# Altium schematic sheet Walrus Power.SchDoc: Power
size B; PageSetup: Record=PageOptions|CenterHorizontal=True|CenterVertical=True|PrintScale=1.05|XCorrection=1.00|YCorrection=1.00|PrintKind=2|BorderSize=5000000|LeftOffset=0|BottomOffset=0|Orientation=2|PaperLength=1000|PaperWidth=1000|Scale=100|PaperSource=7|PrintQuality=-4|MediaType=1|DitherType=10|PaperKind=Letter|PrintScaleMode=1; Organization: Morewood Design Labs, Inc.; Address1: 5001 Baum Blvd.; Address2: Suite 675; Address3: Pittsburgh, PA 15213; Address4: 412-687-1110; SheetNumber: 2; SheetTotal: 4; Client: Test; Project: {ENTER PROJECT}; MdlPcbNumber: Test; ClientPcbNumber: Test; ClientPcbaNumber: Test; ClientPcbaRev: Test; ClientPcbRev: Test; ProjectName: Walrus
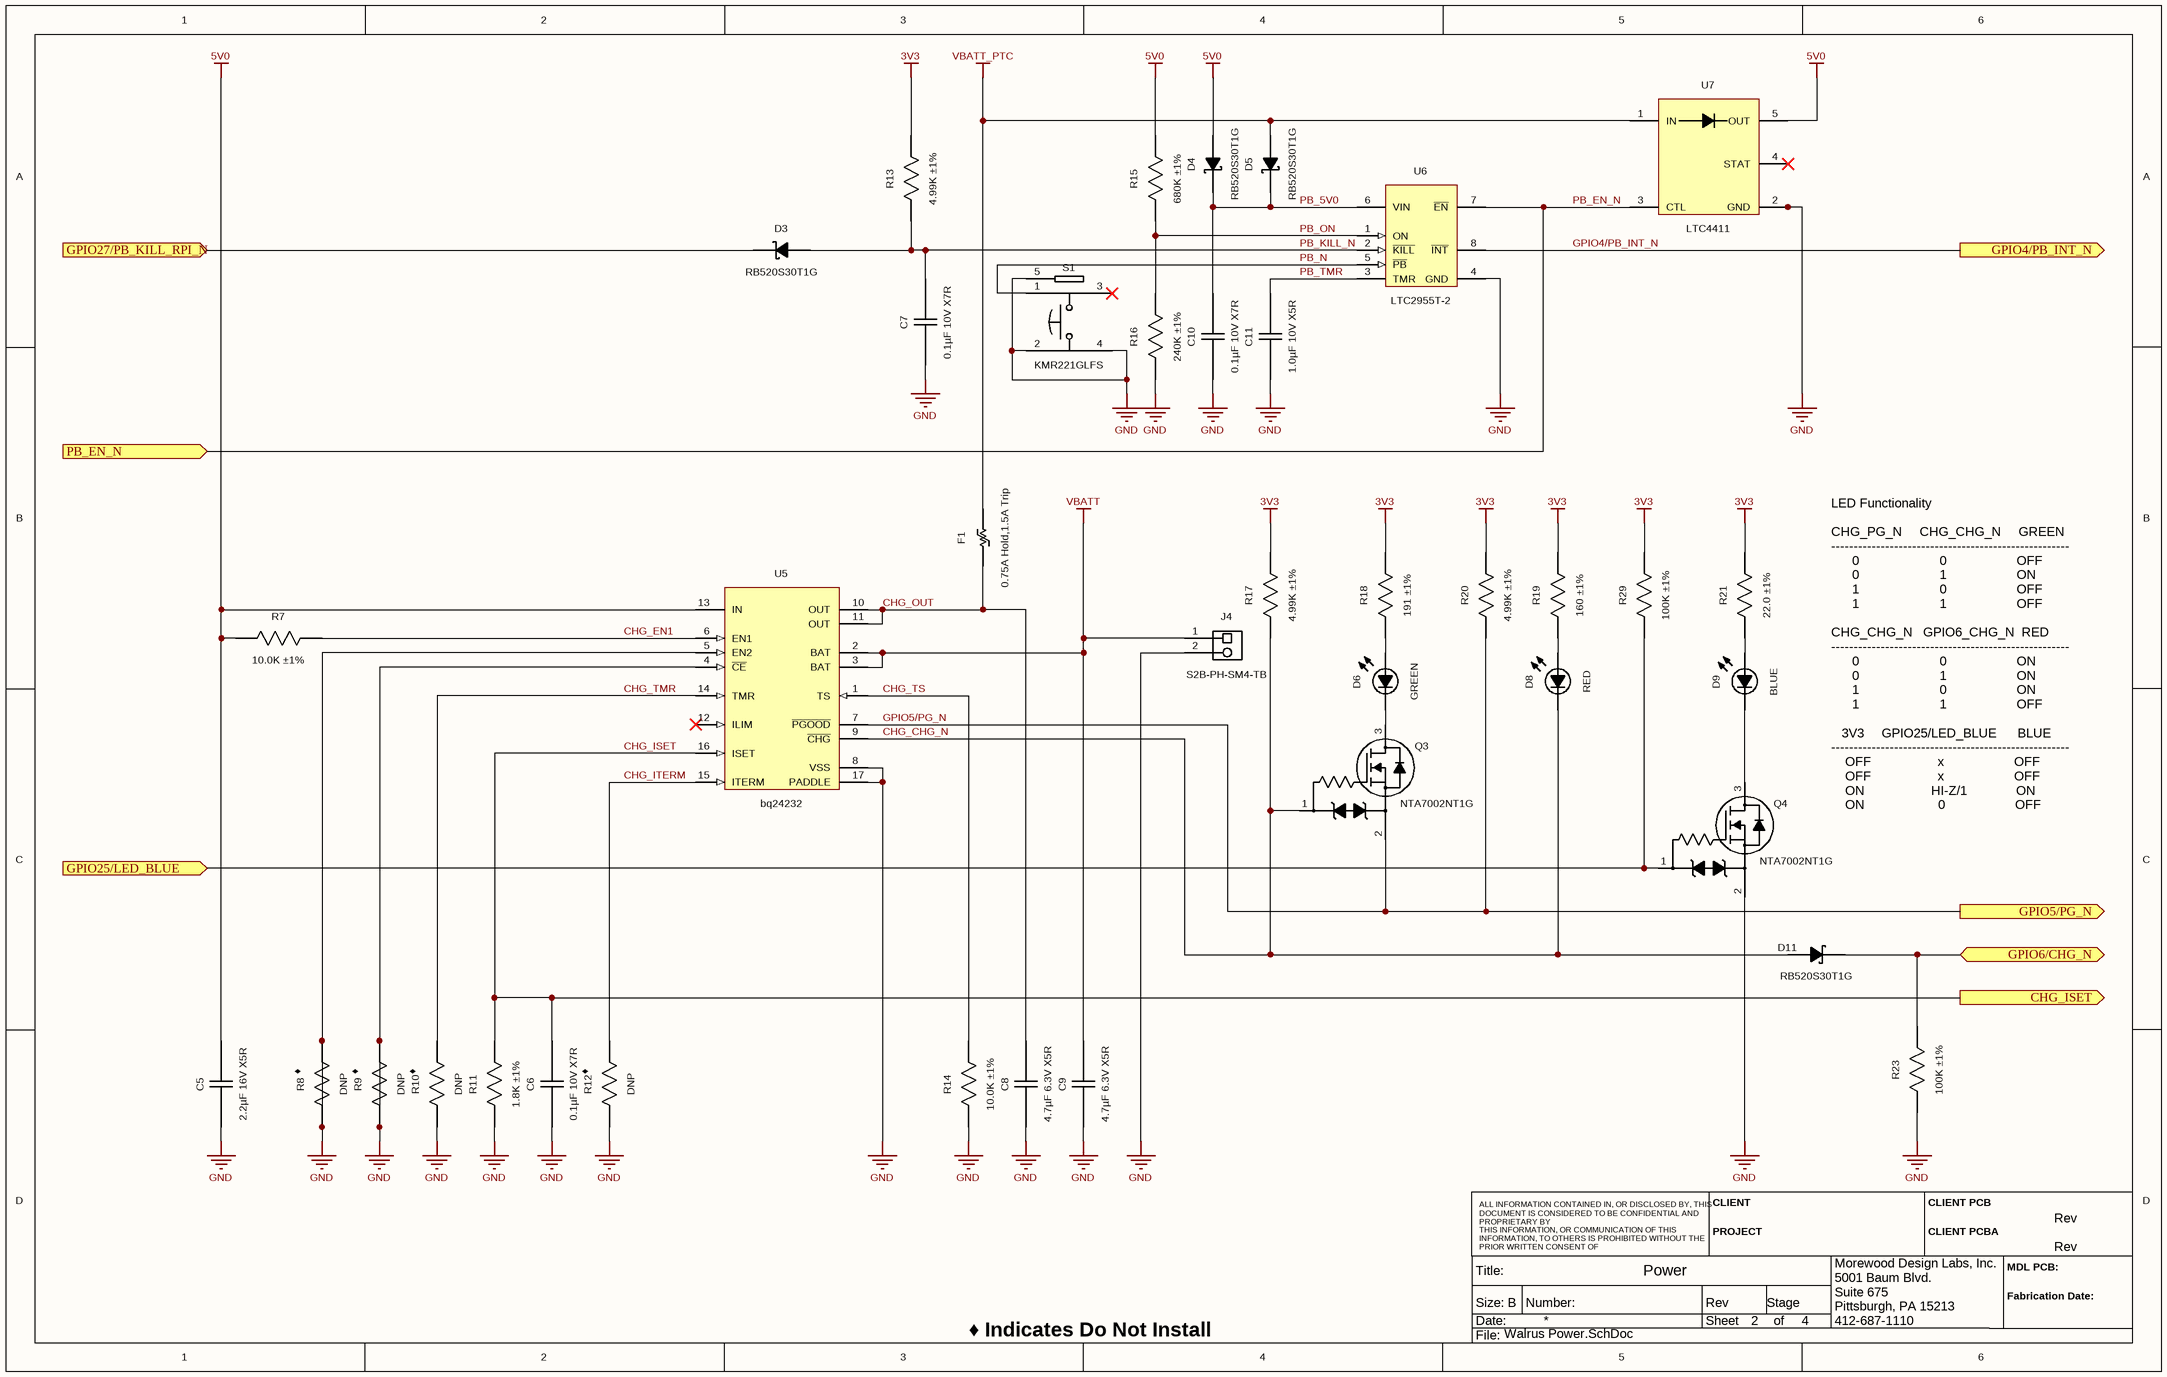
[diagram p0: Walrus Power.SchDoc]

## Parts
C5  2.2µF 16V X5R  [CAPC1005X60L(0402)]
C6  0.1µF 10V X7R  [CAPC1005X60L(0402_FLEXTRONICS)]
C7  0.1µF 10V X7R  [CAPC1005X60L(0402_FLEXTRONICS)]
C8  4.7µF 6.3V X5R  [CAPC1005X60L(0402)]
C9  4.7µF 6.3V X5R  [CAPC1005X60L(0402)]
C10  0.1µF 10V X7R  [CAPC1005X60L(0402_FLEXTRONICS)]
C11  1.0µF 10V X5R  [CAPC1005X60L(0402_FLEXTRONICS)]
D3  RB520S30T1G  [SODFL1608X70L(SOD-523)]
D4  RB520S30T1G  [SODFL1608X70L(SOD-523)]
D5  RB520S30T1G  [SODFL1608X70L(SOD-523)]
D6  GREEN  [DIOC1608X90L(0603)_GREEN]
D8  RED  [DIOC1608X90L(0603)_RED]
D9  BLUE  [DIOC1608X90L(0603)_BLUE]
D11  RB520S30T1G  [SODFL1608X70L(SOD-523)]
F1  0.75A Hold,1.5A Trip  [FUSC1608X60N(0603)]
J4  S2B-PH-SM4-TB  [JST_S2B-PH-SM4-TB]
Q3  NTA7002NT1G  [SOT50P160X90-3L(SOT416, SC75)]
Q4  NTA7002NT1G  [SOT50P160X90-3L(SOT416, SC75)]
R7  10.0K ±1%  [RESC1005X40L(0402)]
R8  DNP  DNI: ♦  [RESC1005X40L(0402)_DNP]
R9  DNP  DNI: ♦  [RESC1005X40L(0402)_DNP]
R10  DNP  DNI: ♦  [RESC1005X40L(0402)_DNP]
R11  1.8K ±1%  [RESC1005X40L(0402)]
R12  DNP  DNI: ♦  [RESC1005X40L(0402)_DNP]
R13  4.99K ±1%  [RESC1005X40L(0402)]
R14  10.0K ±1%  [RESC1005X40L(0402)]
R15  680K ±1%  [RESC1005X40L(0402)]
R16  240K ±1%  [RESC1005X40L(0402)]
R17  4.99K ±1%  [RESC1005X40L(0402)]
R18  191 ±1%  [RESC1005X40L(0402)]
R19  160 ±1%  [RESC1005X40L(0402)]
R20  4.99K ±1%  [RESC1005X40L(0402)]
R21  22.0 ±1%  [RESC1005X40L(0402)]
R23  100K ±1%  [RESC1005X40L(0402)]
R29  100K ±1%  [RESC1005X40L(0402)]
S1  KMR221GLFS  [KMR221GLFS]
U5  bq24232  [QFN50P300X300X100-17N(bq24232)]
U6  LTC2955T-2  [SOT65P280X100-8L(TSOT23-8)]
U7  LTC4411  [SOT95P280X100-5L(TSOT23 -5)]

## Ports
CHG_ISET (out), GPIO4/PB_INT_N (out), GPIO5/PG_N (out), GPIO6/CHG_N (bidir), GPIO25/LED_BLUE (in), GPIO27/PB_KILL_RPI_N (in), PB_EN_N (in)

## Nets
3V3: R13.2 R17.2 R18.2 R19.2 R20.2 R21.2 R29.2
5V0: C5.2 D4.2(A) R7.1 R15.2 U5.13(IN) U7.5(OUT)
GND: C5.1 C6.1 C7.1 C8.1 C9.1 C10.1 C11.1 J4.2 Q4.2(S) R8.1 R8.2 R9.1 R9.2 R10.1 R11.1 R12.1 R14.1 R16.1 R23.1 S1.2(B) S1.4(B') S1.5(BODY) U5.4(~{CE}) U5.5(EN2) U5.8(VSS) U5.17(PADDLE) U6.4(GND) U7.2(GND)
VBATT: C9.2 J4.1 U5.2(BAT) U5.3(BAT)
VBATT_PTC: D5.2(A) F1.2 U7.1(IN)
CHG_CHG_N: D8.1(K) D11.2(A) Q3.1(G) R17.1 U5.9(~{CHG})
CHG_EN1: R7.2 U5.6(EN1)
CHG_ISET: C6.2 R11.2 U5.16(ISET) ; port CHG_ISET
CHG_ITERM: R12.2 U5.15(ITERM)
CHG_OUT: C8.2 F1.1 U5.10(OUT) U5.11(OUT)
CHG_TMR: R10.2 U5.14(TMR)
CHG_TS: R14.2 U5.1(TS)
GPIO4/PB_INT_N: U6.8(~{INT}) ; port GPIO4/PB_INT_N
GPIO5/PG_N: Q3.2(S) R20.1 U5.7(~{PGOOD}) ; port GPIO5/PG_N
GPIO6/CHG_N: D11.1(K) R23.2 ; port GPIO6/CHG_N
GPIO25/LED_BLUE: Q4.1(G) R29.1 ; port GPIO25/LED_BLUE
GPIO27/PB_KILL_RPI_N: D3.1(K) ; port GPIO27/PB_KILL_RPI_N
PB_5V0: C10.2 D4.1(K) D5.1(K) U6.6(VIN)
PB_EN_N: U6.7(~{EN}) U7.3(CTL) ; port PB_EN_N
PB_KILL_N: C7.2 D3.2(A) R13.1 U6.2(~{KILL})
PB_N: S1.1(A) U6.5(~{PB})
PB_ON: R15.1 R16.2 U6.1(ON)
PB_TMR: C11.2 U6.3(TMR)
NetD6_1: D6.1(K) Q3.3(D)
NetD6_2: D6.2(A) R18.1
NetD8_2: D8.2(A) R19.1
NetD9_1: D9.1(K) Q4.3(D)
NetD9_2: D9.2(A) R21.1

Not connected (* = marked no-connect by the designer): S1 3(A')*; U5 12(ILIM)*; U7 4(STAT)*

## Notes on the sheet
- LED Functionality
  CHG_PG_N     CHG_CHG_N     GREEN
  -----------------------------------------------------
  0                       0                    OFF
  0                       1                    ON
  1                       0                    OFF
  1                       1                    OFF
  CHG_CHG_N   GPIO6_CHG_N  RED
  -----------------------------------------------------
  0                       0                    ON
  0                       1                    ON
  1                       0                    ON
  1                       1                    OFF
  3V3     GPIO25/LED_BLUE      BLUE
  -----------------------------------------------------
  OFF                   x                    OFF
  OFF                   x                    OFF
  ON                   HI-Z/1              ON
  ON                     0                    OFF
- ♦ Indicates Do Not Install
- ALL INFORMATION CONTAINED IN, OR DISCLOSED BY, THIS DOCUMENT IS CONSIDERED TO BE CONFIDENTIAL AND PROPRIETARY BY
- THIS INFORMATION, OR COMMUNICATION OF THIS INFORMATION, TO OTHERS IS PROHIBITED WITHOUT THE PRIOR WRITTEN CONSENT OF
- CLIENT
- PROJECT
- CLIENT PCB
- CLIENT PCBA
- MDL PCB:
- Rev
- Title:
- Size:
- Date:
- B
- Number:
- Sheet
- Stage
- of
- Fabrication Date:
- File:

## Library data of the parts
C5 = CAP_000166: Ceramic Chip Capacitor; Mfg1PartNumber: C1005X5R1C225K050BC; Tolerance: ±10%; Mfg1: TDK; MDLPartNumber: CAP_000166; Value: 2.2µF; Dialectric: Ceramic; Voltage: 16V; Mounting: SMT; Case: 1005(0402); Height: 0.55mm(21.7mils); Tempco: X5R; OperatingTemp: -55C to 85C; CreationDate: 3/17/2013; Creator: R. Casciola; LeadFree: True; RoHS: True; Packaging: T&R; ComponentLink1Description: Mfg1 Datasheet; ComponentLink1URL: http://product.tdk.com/capacitor/mlcc/en/documents/mlccspec_commercial_general_midvoltage_en.pdf; Distributor: https://www.digikey.com/product-detail/en/tdk-corporation/C1005X5R1C225K050BC/445-9085-1-ND/3661600
C6 C7 C10 = CAP_000208: Ceramic Chip Capacitor; Mfg1PartNumber: GRM155R71A104KA01D; Tolerance: ±10%; Mfg1: Murata; MDLPartNumber: CAP_000208; Value: 0.1µF; Dielectric: Ceramic; Voltage: 10V; Mounting: SMT; Case: 1005(0402); Height: 0.55mm(21.7mils); Tempco: X7R; OperatingTemp: -55C to 125C; CreationDate: 5/29/2017; Creator: R. Casciola; LeadFree: True; RoHS: True; Packaging: T&R; ComponentLink1Description: Mfg1 Datasheet; ComponentLink1URL: http://search.murata.co.jp/Ceramy/image/img/A01X/G101/ENG/GRM155R71A104KA01-01.pdf; Distributor: https://www.digikey.com/product-detail/en/murata-electronics-north-america/GRM155R71A104KA01D/490-6321-1-ND/3845518
C8 C9 = CAP_000063: Ceramic Chip Capacitor; Mfg1PartNumber: GRM155R60J475ME87D; Mfg2PartNumber: JMK105BBJ475MV-F; Tolerance: ±20%; Mfg1: Murata; MDLPartNumber: CAP_000063; Value: 4.7µF; Dialectric: Ceramic; Voltage: 6.3V; Mounting: SMT; Case: 1005(0402); Height: 0.60mm(23.6mils); Tempco: X5R; OperatingTemp: -55C to 85C; CreationDate: 1/29/2011; Creator: R. Casciola; LeadFree: True; RoHS: True; Packaging: T&R; ComponentLink1Description: Mfg1 Datasheet; ComponentLink1URL: http://www.murata.com/products/catalog/pdf/c02e.pdf; ComponentLink2Description: Mfg2 Datasheet; ComponentLink2URL: http://www.yuden.co.jp/or/product/category/capacitor/JMK105BBJ475MV-F.pdf; Mfg2: Taiyo Yuden; Distributor: https://www.digikey.com/product-detail/en/murata-electronics-north-america/GRM155R60J475ME87D/490-5408-1-ND/2175215
C11 = CAP_000094: Ceramic Chip Capacitor; Mfg1PartNumber: 0402ZD105KAT2A; Tolerance: ±10%; Mfg1: AVX; MDLPartNumber: CAP_000094; Value: 1.0µF; Dielectric: Ceramic; Voltage: 10V; Mounting: SMT; Case: 1005(0402); Height: 0.56mm(22.0mils); Tempco: X5R; OperatingTemp: -55C to 85C; CreationDate: 7/19/2011; Creator: R. Casciola; LeadFree: True; RoHS: True; Packaging: T&R; ComponentLink1Description: Mfg1 Datasheet; ComponentLink1URL: http://www.avx.com/docs/Catalogs/cx5r.pdf; Distributor: https://www.digikey.com/product-detail/en/avx-corporation/0402ZD105KAT2A/478-4596-1-ND/1645907
D3-D5 D11 = DIOD_000001: Schottky Barrier Diode; MaxReverseVoltage: 30V; MaxForwardCurrent (mA): 200mA; MaxReverseLeakage: 1.0µA; MaxForwardVoltage: 0.60V@200mA; Mfg1: ON Seminconductor; MDLPartNumber: DIOD_000001; Type: Schottky; Mounting: SMT; Pins: 2; Case: SOD-523; Height: 0.70mm(27.6mils); CreationDate: 4/7/2010; Creator: R. Casciola; LeadFree: True; RoHS: True; Packaging: T&R; Mfg1PartNumber: RB520S30T1G; ComponentLink1Description: Mfg1 Datasheet; ComponentLink1URL: http://www.onsemi.com/pub_link/Collateral/RB520S30T1-D.PDF; Distributor: https://www.digikey.com/product-detail/en/on-semiconductor/RB520S30T1G/RB520S30T1GOSCT-ND/964626
D6 = DIOD_000061: Surface Mounting Chip LED; Mfg1PartNumber: LTST-C190KGKT; Lense: Clear; Mfg1: Lite-On; MDLPartNumber: DIOD_000061; Type: LED; Mounting: SMT; Pins: 2; Case: 1608(0603); Height: 0.80mm(31.5mils); Color: Green; CreationDate: 2/15/2015; Creator: R. Casciola; LeadFree: True; RoHS: True; Packaging: T&R; ComponentLink1Description: Mfg1 Datasheet; ComponentLink1URL: http://optoelectronics.liteon.com/upload/download/DS22-2000-074/S_110_LTST-C190KGKT.pdf; Distributor: https://www.digikey.com/product-detail/en/lite-on-inc/LTST-C190KGKT/160-1435-1-ND/386814
D8 = DIOD_000068: Surface Mounting Chip LED; Mfg1PartNumber: LTST-C190CKT; MaxReverseVoltage: 5V; MaxForwardCurrent (mA): 40mA; PeakPulseCurrent: 200mA; MaxReverseLeakage: 100µA; TypForwardVoltage: 1.8V@20mA; MaxForwardVoltage: 2.4@20mA; MaxPower: 100mW; Lense: Clear; Mfg1: Lite-On; MDLPartNumber: DIOD_000068; Type: LED; Mounting: SMT; Pins: 2; Case: 1608(0603); Height: 0.80mm(31.5mils); Color: Red; CreationDate: 8/24/2016; Creator: R. Casciola; LeadFree: True; RoHS: True; Packaging: T&R; ComponentLink1Description: Mfg1 Datasheet; ComponentLink1URL: http://media.digikey.com/pdf/Data%20Sheets/Lite-On%20PDFs/LTST-C190CKT.pdf; Distributor: https://www.digikey.com/product-detail/en/lite-on-inc/LTST-C190CKT/160-1181-1-ND/269253
D9 = DIOD_000059: Surface Mounting Chip LED; Mfg1PartNumber: LTST-C190TBKT; Lense: Clear; Mfg1: Lite-On; MDLPartNumber: DIOD_000059; Type: LED; Mounting: SMT; Pins: 2; Case: 1608(0603); Height: 0.80mm(31.5mils); Color: Blue; CreationDate: 2/15/2015; Creator: R. Casciola; LeadFree: True; RoHS: True; Packaging: T&R; ComponentLink1Description: Mfg1 Datasheet; ComponentLink1URL: http://optoelectronics.liteon.com/upload/download/DS-22-99-0224/S_110_LTST-C190TBKT(0630).pdf; Distributor: https://www.digikey.com/product-detail/en/lite-on-inc/LTST-C190TBKT/160-1646-1-ND/573586
F1 = FUSE_000007: POLY-FUSE® Resettable PTC, Surface Mount > LoRho Series; Mfg1PartNumber: 0603L075SLYR; I_hold: 0.75A @ 20C; I_trip: 1.5A @ 20C; I_max: 50A; V_max: 6; P_d: 0.6W @ 20C; R_min: 0.05 ohms @ 20C; R1_max: 0.25 ohms @ 20C; Mfg1: Littelfuse; MDLPartNumber: FUSE_000007; Value: 0.75A; Mounting: SMT; Case: 1608(0603); Height: 0.75mm(29.5mils); OperatingTemp: -40C to 85C; CreationDate: 8/20/2015; Creator: R. Casciola; LeadFree: True; RoHS: True; Packaging: T&R; ComponentLink1Description: Mfg1 Datasheet; ComponentLink1URL: http://www.littelfuse.com/~/media/electronics/datasheets/resettable_ptcs/littelfuse_ptc_lorho_datasheet.pdf.pdf; Distributor: https://www.digikey.com/product-detail/en/littelfuse-inc/0603L075SLYR/F5777CT-ND/3661919
J4 = CONN_000190: PH CONNECTOR/2.0MM Pitch Side Entry; Mfg1PartNumber: S2B-PH-SM4-TB,S2B-PH-SM4-TB(LF)(SN); Mfg1: JST; Modifer: R. Casciola; MDLPartNumber: CONN_000190; Mounting: SMT; Height: 5.5mm; CreationDate: 7/4/2017; Creator: R. Casciola; LeadFree: True; RoHS: True; ComponentLink1Description: Mfg1 Datasheet; ComponentLink1URL: http://www.jst-mfg.com/product/pdf/eng/ePH.pdf; Distributor: https://www.digikey.com/product-detail/en/jst-sales-america-inc/S2B-PH-SM4-TB(LF)(SN)/455-1749-1-ND/926846; ModificationDate: 8/24/2017
Q3 Q4 = TRAN_000002: Small Signal MOSFET; Type: MOSFET, N-Channel, Single; MaxVdss: 30V; MaxVgs: ±10V; MaxContinuousDrainCurrent: 154mA; MaxPowerDissipation: 300mW; OperatingJunctionTemperatureRange: -55C to 150C; Modifer: R. Casciola; Mfg1: ON Seminconductor; MDLPartNumber: TRAN_000002; Mounting: SMT; Pins: 3; Case: SOT416, SC75; Height: 0.90mm(35.4mils); CreationDate: 4/8/2010; Creator: R. Casciola; ModificationDate: 5/4/2012; LeadFree: True; RoHS: True; Packaging: T&R; Mfg1PartNumber: NTA7002NT1G; ComponentLink1Description: Mfg1 Datasheet; ComponentLink1URL: http://www.onsemi.com/pub_link/Collateral/NTA7002N-D.PDF; Distributor: https://www.digikey.com/product-detail/en/on-semiconductor/NTA7002NT1G/NTA7002NT1GOSCT-ND/1484663
R7 R14 = RES_000005: Chip Resistor, Thick Film; Mfg1PartNumber: CRCW040210K0FKED; Power: 0.063W; LE Voltage: 50V; Tempco: ±100ppm/C; Mfg1: Vishay/Dale; DNI: *; MDLPartNumber: RES_000005; Value: 10.0K; Tolerance: ±1%; Mounting: SMT; Case: 1005(0402); Height: 0.40mm(15.7mils); Composition: Thick Film; OperatingTemp: -55C to 155C; CreationDate: 4/13/2010; Creator: R. Casciola; LeadFree: True; RoHS: True; Packaging: T&R; ComponentLink1Description: Mfg1 Datasheet; ComponentLink1URL: http://www.vishay.com/docs/20035/dcrcwe3.pdf; Distributor: https://www.digikey.com/product-detail/en/vishay-dale/CRCW040210K0FKED/541-10.0KLCT-ND/1183237
R8-R10 R12 = RES_000064: Chip Resistor, Thick Film; MDLPartNumber: RES_000064; Mounting: SMT; Case: 1005(0402); CreationDate: 12/4/2010; Creator: R. Casciola; LeadFree: True; RoHS: True
R11 = RES_000288: Chip Resistor, Thick Film; Mfg1PartNumber: CRCW04021K80FKED; Mfg2PartNumber: RC0402FR-071K8L; Power: 0.063W; LE Voltage: 50V; Tempco: ±100ppm/°C; Mfg1: Vishay/Dale; DNI: *; MDLPartNumber: RES_000288; Value: 1.8K; Tolerance: ±1%; Mounting: SMT; Case: 1005(0402); Height: 0.40mm(15.7mils); Composition: Thick Film; OperatingTemp: -55C to 155C; CreationDate: 7/23/2017; Creator: R. Casciola; LeadFree: True; RoHS: True; Packaging: T&R; ComponentLink1Description: Mfg1 Datasheet; ComponentLink1URL: http://www.vishay.com/docs/20035/dcrcwe3.pdf; Mfg2: Yageo; ComponentLink2Description: Mfg2 Datasheet; ComponentLink2URL: http://www.yageo.com/NewPortal/yageodocoutput?fileName=/pdf/R-Chip/PYu-RC_Group_51_RoHS_L_5.pdf; Distributor: https://www.digikey.com/product-detail/en/vishay-dale/CRCW04021K80FKED/541-1.80KLCT-ND/1183150
R13 R17 R20 = RES_000003: Chip Resistor, Thick Film; Mfg1PartNumber: CRCW04024K99FKED; Power: 0.063W; LE Voltage: 50V; Tempco: ±100ppm/C; Mfg1: Vishay/Dale; DNI: *; MDLPartNumber: RES_000003; Value: 4.99K; Tolerance: ±1%; Mounting: SMT; Case: 1005(0402); Height: 0.40mm(15.7mils); Composition: Thick Film; OperatingTemp: -55C to 155C; CreationDate: 4/6/2010; Creator: R. Casciola; LeadFree: True; RoHS: True; Packaging: T&R; ComponentLink1Description: Mfg1 Datasheet; ComponentLink1URL: http://www.vishay.com/docs/20035/dcrcwe3.pdf; Distributor: https://www.digikey.com/product-detail/en/vishay-dale/CRCW04024K99FKED/541-4.99KLCT-ND/1183202
R15 = RES_000103: Chip Resistor, Thick Film; Mfg1PartNumber: CRCW0402680KFKED; Power: 0.063W; LE Voltage: 50V; Tempco: ±100ppm/C; Mfg1: Vishay/Dale; DNI: *; MDLPartNumber: RES_000103; Value: 680K; Tolerance: ±1%; Mounting: SMT; Case: 1005(0402); Height: 0.40mm(15.7mils); Composition: Thick Film; OperatingTemp: -55C to 155C; CreationDate: 5/25/2011; Creator: R. Casciola; LeadFree: True; RoHS: True; Packaging: T&R; ComponentLink1Description: Mfg1 Datasheet; ComponentLink1URL: http://www.vishay.com/docs/20035/dcrcwe3.pdf; Distributor: https://www.digikey.com/product-detail/en/vishay-dale/CRCW0402680KFKED/541-680KLCT-ND/1183446
R16 = RES_000165: Chip Resistor, Thick Film; Mfg1PartNumber: CRCW0402240KFKED; Power: 0.063W; LE Voltage: 50V; Tempco: ±100ppm/C; Mfg1: Vishay/Dale; DNI: *; MDLPartNumber: RES_000165; Value: 240K; Tolerance: ±1%; Mounting: SMT; Case: 1005(0402); Height: 0.40mm(15.7mils); Composition: Thick Film; OperatingTemp: -55C to 155C; CreationDate: 1/6/2012; Creator: R. Casciola; LeadFree: True; RoHS: True; Packaging: T&R; ComponentLink1Description: Mfg1 Datasheet; ComponentLink1URL: http://www.vishay.com/docs/20035/dcrcwe3.pdf; Distributor: https://www.digikey.com/product-detail/en/vishay-dale/CRCW0402240KFKED/541-240KLCT-ND/1183392
R18 = RES_000287: Chip Resistor, Thick Film; Mfg1PartNumber: CRCW0402191RFKED; Mfg2PartNumber: RC0402FR-07191RL; Value: 191; Power: 0.063W; LE Voltage: 50V; Tempco: ±100ppm/°C; Mfg1: Vishay/Dale; DNI: *; MDLPartNumber: RES_000287; Tolerance: ±1%; Mounting: SMT; Case: 1005(0402); Height: 0.40mm(15.7mils); Composition: Thick Film; OperatingTemp: -55C to 155C; CreationDate: 7/23/2017; Creator: R. Casciola; LeadFree: True; RoHS: True; Packaging: T&R; ComponentLink1Description: Mfg1 Datasheet; ComponentLink1URL: http://www.vishay.com/docs/20035/dcrcwe3.pdf; Mfg2: Yageo; ComponentLink2Description: Mfg2 Datasheet; ComponentLink2URL: http://www.yageo.com/documents/recent/PYu-RC_Group_51_RoHS_L_7.pdf; Distributor: https://www.digikey.com/product-detail/en/vishay-dale/CRCW0402191RFKED/541-191LCT-ND/1183039
R19 = RES_000286: Chip Resistor, Thick Film; Mfg1PartNumber: CRCW0402160RFKED; Mfg2PartNumber: RC0402FR-07160RL; Value: 160; Power: 0.063W; LE Voltage: 50V; Tempco: ±100ppm/°C; Mfg1: Vishay/Dale; DNI: *; MDLPartNumber: RES_000286; Tolerance: ±1%; Mounting: SMT; Case: 1005(0402); Height: 0.40mm(15.7mils); Composition: Thick Film; OperatingTemp: -55C to 155C; CreationDate: 7/23/2017; Creator: R. Casciola; LeadFree: True; RoHS: True; Packaging: T&R; ComponentLink1Description: Mfg1 Datasheet; ComponentLink1URL: http://www.vishay.com/docs/20035/dcrcwe3.pdf; Mfg2: Yageo; ComponentLink2Description: Mfg2 Datasheet; ComponentLink2URL: http://www.yageo.com/documents/recent/PYu-RC_Group_51_RoHS_L_7.pdf; Distributor: https://www.digikey.com/product-detail/en/vishay-dale/CRCW0402160RFKED/541-160LCT-ND/1183030
R21 = RES_000158: Chip Resistor, Thick Film; Mfg1PartNumber: CRCW040222R0FKED; Value: 22.0; Power: 0.063W; LE Voltage: 50V; Tempco: ±100ppm/C; Mfg1: Vishay/Dale; DNI: *; MDLPartNumber: RES_000158; Tolerance: ±1%; Mounting: SMT; Case: 1005(0402); Height: 0.40mm(15.7mils); Composition: Thick Film; OperatingTemp: -55C to 155C; CreationDate: 10/28/2011; Creator: R. Casciola; LeadFree: True; RoHS: True; Packaging: T&R; ComponentLink1Description: Mfg1 Datasheet; ComponentLink1URL: http://www.vishay.com/docs/20035/dcrcwe3.pdf; Distributor: https://www.digikey.com/product-detail/en/vishay-dale/CRCW040222R0FKED/541-22.0LCT-ND/1182931
R23 R29 = RES_000067: Chip Resistor, Thick Film; Mfg1PartNumber: CRCW0402100KFKED; Power: 0.063W; LE Voltage: 50V; Tempco: ±100ppm/C; Mfg1: Vishay/Dale; DNI: *; MDLPartNumber: RES_000067; Value: 100K; Tolerance: ±1%; Mounting: SMT; Case: 1005(0402); Height: 0.40mm(15.7mils); Composition: Thick Film; OperatingTemp: -55C to 155C; CreationDate: 12/22/2010; Creator: R. Casciola; LeadFree: True; RoHS: True; Packaging: T&R; ComponentLink1Description: Mfg1 Datasheet; ComponentLink1URL: http://www.vishay.com/docs/20035/dcrcwe3.pdf; Distributor: https://www.digikey.com/product-detail/en/vishay-dale/CRCW0402100KFKED/541-100KLCT-ND/1183351
S1 = SWCH_000001: KMR 2 Series Microminiature SMT Top Actuated; Function: Momentary; Contacts: SPST, N.O.; Action: Pushbutton; VoltageRating: 32VDC; CurrentRating: 50mA; MinimumCurrent: 1mA; ContactResistance: 1mohm; InsulationResistance: 1Gohm; Mfg1: C&K; BounceTime: 3ms; Modifer: R. Casciola; MDLPartNumber: SWCH_000001; Mounting: SMT; Height: 2.10mm(82.7mils); OperatingTemperature: -40C to 85C; CreationDate: 5/5/2010; Creator: R. Casciola; LeadFree: True; RoHS: True; Packaging: T&R; Mfg1PartNumber: KMR221GLFS; ComponentLink1Description: Mfg1 Datasheet; ComponentLink1URL: http://www.ck-components.com/14414/kmr2_8apr.pdf/; ModificationDate: 8/8/2010; Distributor: https://www.digikey.com/product-detail/en/c-k/KMR221GLFS/401-1427-1-ND/550466
U5 = IC_000195: USB-FRIENDLY LITHIUM-ION BATTERY CHARGER AND POWER-PATH MANAGEMENT IC; PartMarking: NXK; Mfg1PartNumber: BQ24232RGTR,BQ24232RGTT; Mfg1: Texas Instruments; Modifer: R. Casciola; MDLPartNumber: IC_000195; Mounting: SMT; Pins: 16; Case: QFN16; Height: 1.00mm(39.4mils); OperatingTemp: -40C to 85C; CreationDate: 3/14/2013; Creator: R. Casciola; LeadFree: True; RoHS: True; Packaging: T&R; ComponentLink1Description: Mfg1 Datasheet; ComponentLink1URL: http://www.ti.com/lit/ds/symlink/bq24232.pdf; Distributor: https://www.digikey.com/product-detail/en/texas-instruments/BQ24232RGTR/296-41207-1-ND/5222663; ModificationDate: 8/24/2017
U6 = IC_000294: Pushbutton On/Off Controller with Automatic Turn-On; PartMarking: LTGBN; Mfg1PartNumber: LTC2955CTS8-2#PBF,LTC2955CTS8-2#TRMPBF,LTC2955CTS8-2#TRPBF; Mfg1: Linear Technology; Modifer: R. Casciola; MDLPartNumber: IC_000294; Mounting: SMT; Pins: 8; Case: TSOT23-8; Height: 1.00mm(39.4mils); OperatingTemp: 0C to 70C; CreationDate: 7/22/2017; Creator: R. Casciola; LeadFree: True; RoHS: True; Packaging: T&R; ComponentLink1Description: Mfg1 Datasheet; ComponentLink1URL: http://cds.linear.com/docs/en/datasheet/2955fa.pdf; Distributor: https://www.digikey.com/product-detail/en/linear-technology/LTC2955CTS8-2-TRMPBF/LTC2955CTS8-2-TRMPBFCT-ND/3065187; ModificationDate: 8/24/2017
U7 = IC_000293: 2.6A Low Loss Ideal Diode in ThinSOT; PartMarking: LTAEN; Mfg1PartNumber: LTC4411ES5,LTC4411ES5#TRMPBF,LTC4411ES5#TRPBF; Mfg1: Linear Technology; Modifer: R. Casciola; MDLPartNumber: IC_000293; Mounting: SMT; Pins: 5; Case: TSOT23-5; Height: 1.00mm(39.4mils); OperatingTemp: -40C to 85C; CreationDate: 7/16/2017; Creator: R. Casciola; LeadFree: True; RoHS: True; Packaging: T&R; ComponentLink1Description: Mfg1 Datasheet; ComponentLink1URL: http://cds.linear.com/docs/en/datasheet/4411fa.pdf; Distributor: https://www.digikey.com/product-detail/en/linear-technology/LTC4411ES5-TRMPBF/LTC4411ES5-TRMPBFCT-ND/1754256; ModificationDate: 8/24/2017